# Altium schematic sheet Esquematico.SchDoc
size A3
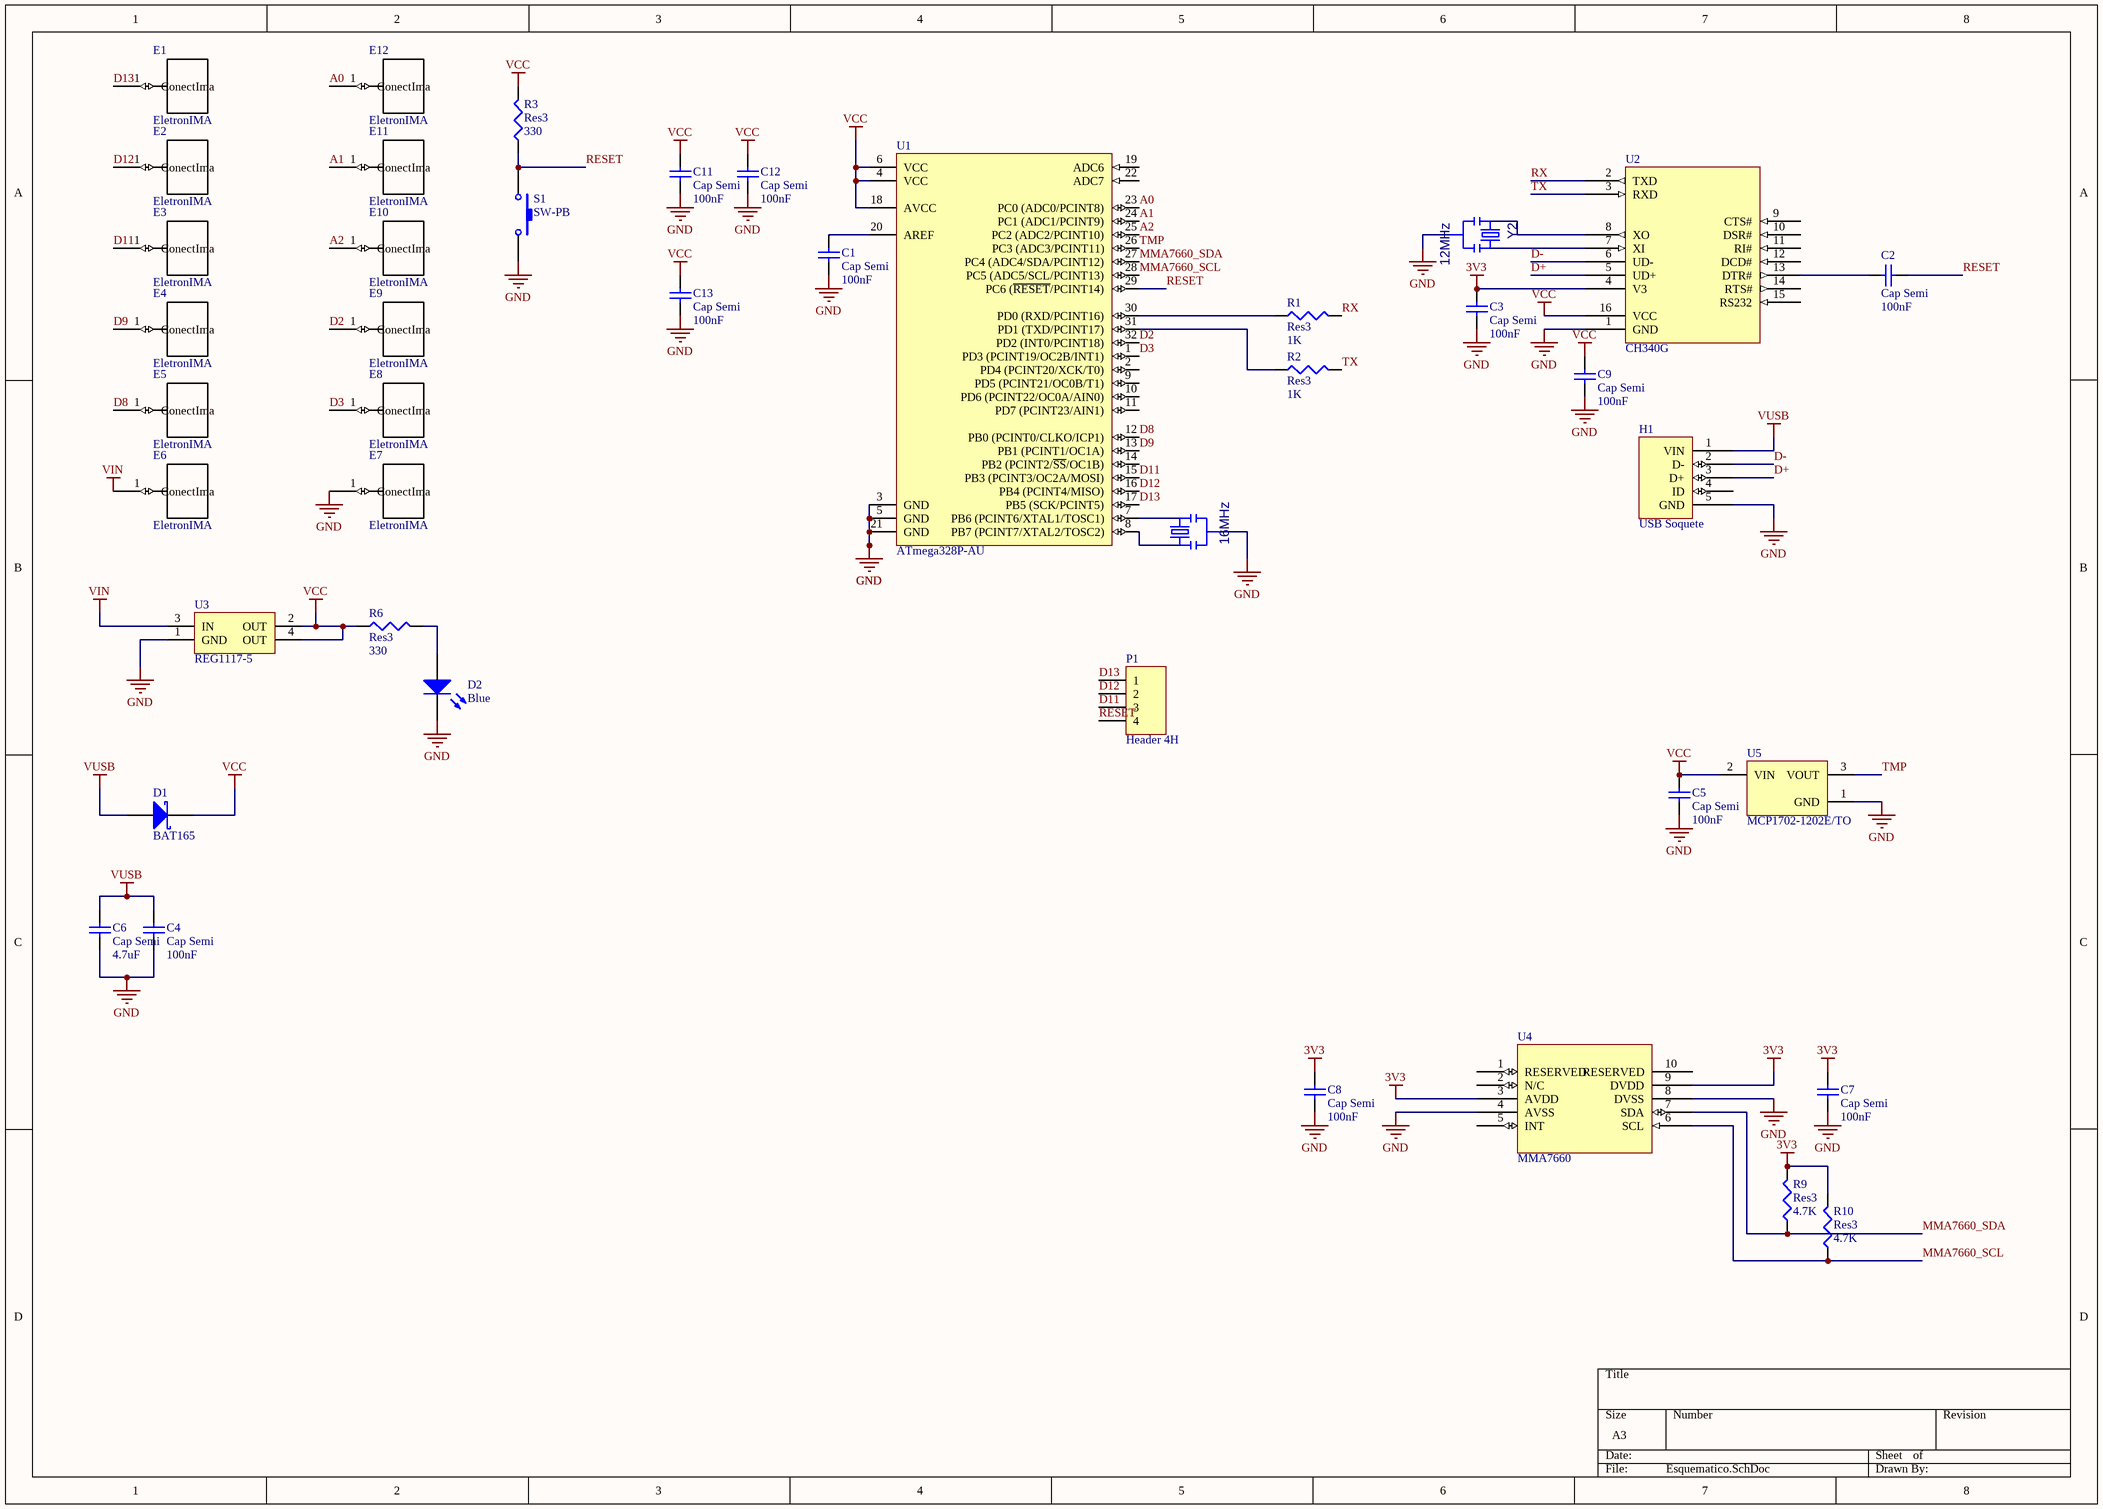
[diagram p0: Esquematico.SchDoc]

## Parts
C1  Cap Semi  value 100nF  [0402]
C2  Cap Semi  value 100nF  [0402]
C3  Cap Semi  value 100nF  [0402]
C4  Cap Semi  value 100nF  [0402]
C5  Cap Semi  value 100nF  [0402]
C6  Cap Semi  value 4.7uF  [0402]
C7  Cap Semi  value 100nF  [0402]
C8  Cap Semi  value 100nF  [0402]
C9  Cap Semi  value 100nF  [0402]
C11  Cap Semi  value 100nF  [0402]
C12  Cap Semi  value 100nF  [0402]
C13  Cap Semi  value 100nF  [0402]
D1  BAT165  [SOD-323]
D2  Blue  [1.6X0.8X0.6]
E1  EletronIMA  [TermIma]
E2  EletronIMA  [TermIma]
E3  EletronIMA  [TermIma]
E4  EletronIMA  [TermIma]
E5  EletronIMA  [TermIma]
E6  EletronIMA  [TermIma]
E7  EletronIMA  [TermIma]
E8  EletronIMA  [TermIma]
E9  EletronIMA  [TermIma]
E10  EletronIMA  [TermIma]
E11  EletronIMA  [TermIma]
E12  EletronIMA  [TermIma]
H1  USB Soquete  [ZX62RD-AB-5P8]
P1  Header 4H  [HDR1X4H]
R1  Res3  value 1K  [J1-0603]
R2  Res3  value 1K  [J1-0603]
R3  Res3  value 330  [J1-0603]
R6  Res3  value 330  [J1-0603]
R9  Res3  value 4.7K  [J1-0603]
R10  Res3  value 4.7K  [J1-0603]
S1  SW-PB  [SPST]
U1  ATmega328P-AU  [32A_N]
U2  CH340G  [SSOP20]
U3  REG1117-5  [SOT-223-DB3_M]
U4  MMA7660  [DFN-MF10]
U5  MCP1702-1202E/TO  [TO-92-TO3]
Y1  16MHz  [X3-SMD-3.6X1.3X0.8MM]
Y2  12MHz  [X3-SMD-3.6X1.3X0.8MM]

## Nets
3V3: C3.2 C7.2 C8.1 R9.2 R10.2 U2.4(V3) U4.3(AVDD) U4.9(DVDD)
GND: C1.1 C3.1 C4.1 C5.1 C6.1 C7.1 C8.2 C9.1 C11.1 C12.1 C13.1 D2.2(K) E7.1(ConectIma) H1.5(GND) S1.2 U1.3(GND) U1.5(GND) U1.21(GND) U2.1(GND) U3.1(GND) U4.4(AVSS) U4.8(DVSS) U5.1(GND) Y1.2 Y2.2
VCC: C5.2 C9.2 C11.2 C12.2 C13.2 D1.1(K) R3.2 R6.1 U1.4(VCC) U1.6(VCC) U1.18(AVCC) U2.16(VCC) U3.2(OUT) U3.4(OUT) U5.2(VIN)
VIN: E6.1(ConectIma) U3.3(IN)
VUSB: C4.2 C6.2 D1.2(A) H1.1(VIN)
A0: E12.1(ConectIma) U1.23(PC0_(ADC0/PCINT8))
A1: E11.1(ConectIma) U1.24(PC1_(ADC1/PCINT9))
A2: E10.1(ConectIma) U1.25(PC2_(ADC2/PCINT10))
D2: E9.1(ConectIma) U1.32(PD2_(INT0/PCINT18))
D3: E8.1(ConectIma) U1.1(PD3_(PCINT19/OC2B/INT1))
D8: E5.1(ConectIma) U1.12(PB0_(PCINT0/CLKO/ICP1))
D9: E4.1(ConectIma) U1.13(PB1_(PCINT1/OC1A))
D11: E3.1(ConectIma) P1.3 U1.15(PB3_(PCINT3/OC2A/MOSI))
D12: E2.1(ConectIma) P1.2 U1.16(PB4_(PCINT4/MISO))
D13: E1.1(ConectIma) P1.1 U1.17(PB5_(SCK/PCINT5))
D+: H1.3(D+) U2.5(UD+)
D-: H1.2(D-) U2.6(UD-)
MMA7660_SCL: R10.1 U1.28(PC5_(ADC5/SCL/PCINT13)) U4.6(SCL)
MMA7660_SDA: R9.1 U1.27(PC4_(ADC4/SDA/PCINT12)) U4.7(SDA)
RESET: C2.2 P1.4 R3.1 S1.1 U1.29(PC6_(~{RESET}/PCINT14))
RX: R1.2 U2.2(TXD)
TMP: U1.26(PC3_(ADC3/PCINT11)) U5.3(VOUT)
TX: R2.2 U2.3(RXD)
NetC1_2: C1.2 U1.20(AREF)
NetC2_1: C2.1 U2.13(DTR#)
NetD2_1: D2.1(A) R6.2
NetR1_1: R1.1 U1.30(PD0_(RXD/PCINT16))
NetR2_1: R2.1 U1.31(PD1_(TXD/PCINT17))
NetU1_7: U1.7(PB6_(PCINT6/XTAL1/TOSC1)) Y1.3
NetU1_8: U1.8(PB7_(PCINT7/XTAL2/TOSC2)) Y1.1
NetU2_7: U2.7(XI) Y2.3
NetU2_8: U2.8(XO) Y2.1

Not connected (* = marked no-connect by the designer): H1 4(ID); U1 2(PD4_(PCINT20/XCK/T0)) 9(PD5_(PCINT21/OC0B/T1)) 10(PD6_(PCINT22/OC0A/AIN0)) 11(PD7_(PCINT23/AIN1)) 14(PB2_(PCINT2/~{SS}/OC1B)) 19(ADC6) 22(ADC7); U2 9(CTS#) 10(DSR#) 11(RI#) 12(DCD#) 14(RTS#) 15(RS232); U4 1(RESERVED) 2(N/C) 5(INT) 10(RESERVED)

## Library data of the parts
C1-C9 C11-C13 = Cap Semi: Capacitor (Semiconductor SIM Model); Published: 8-Jun-2000; LatestRevisionDate: 29-May-2009; LatestRevisionNote: IPC-7351 Footprint Added.; PackageReference: C1206; Publisher: Altium Limited; PackageDescription: Chip Capacitor
D1 = BAT165: Silicon AF Schottky Rectifier Diode; Published: 21-Mar-2003; LatestRevisionDate: 19-Mar-2004; LatestRevisionNote: Silkscreen size reduced.; DatasheetDocument: Oct-1999; PackageDocument: Sep-2000; PackageReference: SOD-323; Publisher: Altium Limited; ComponentLink1Description: Manufacturer Link; ComponentLink1URL: http://www.infineon.com/; ComponentLink2Description: Datasheet; ComponentLink2URL: http://www.infineon.com/upload/Document/cmc_upload/documents/009/391/bat165series_1.pdf
D2 = HSMR-C191: Top Mount Low Profile Chip LED, Blue; LuminousIntensity: 16mcd (Minimum).; PCB_Layout: Complies with manufacturer's recommendation.; Published: 11-Dec-2002; DatasheetDocument: 6-Apr-2002; PackageDocument: 11-Mar-2002; PackageReference: 1.6X0.8X0.6; Publisher: Altium Limited; LED_Colour: Blue; ComponentLink1Description: Manufacturer Link; ComponentLink1URL: http://www.agilent.com/; ComponentLink2Description: Datasheet; ComponentLink2URL: http://cp.literature.agilent.com/litweb/pdf/5988-4832EN.pdf
P1 = Header 4H: Header, 4-Pin, Right Angle; LatestRevisionDate: 17-Jul-2002; LatestRevisionNote: Re-released for DXP Platform.; Publisher: Altium Limited
R1-R3 R6 R9 R10 = Res3: Resistor; Published: 8-Jun-2000; LatestRevisionDate: 29-May-2009; LatestRevisionNote: IPC-7351 Footprint Added.; PackageReference: J1-0603; Publisher: Altium Limited; PackageDescription: Chip Resistor
S1 = SW-PB: Switch; Published: 24-Mar-1999; LatestRevisionDate: 17-Jul-2002; LatestRevisionNote: Re-released for DXP Platform.; PackageReference: SPST-2; Publisher: Altium Limited; PackageDescription: Switch; 2 Leads
U1 = ATmega328P-AU: 8-bit AVR Microcontroller, 32KB Flash, 1KB EEPROM, 2KB SRAM, 32-pin TQFP, Industrial Grade (-40°C to 85°C); Published: 1-Apr-2010; DatasheetVersion: revA, Jan-2010; PackageVersion: revB, Oct-2001; PackageReference: 32A; Publisher: Altium Limited; PackageDescription: 32-Lead, 7x7x1.0 mm Body, 0.8mm Lead Pitch, Thin Profile Plastic Quad Flat Package (TQFP); Supplier 1: Digi-Key; Supplier Part Number 1: ATMEGA328P-AU-ND; Supplier 2: Farnell; Supplier Part Number 2: 1715486; Supplier 3: Mouser; Supplier Part Number 3: 556-ATMEGA328P-AU; Code_JEDEC: MS-026-ABA; ComponentLink1Description: Manufacturer Link; ComponentLink1URL: http://www.atmel.com/products/avr/default.asp?; ComponentLink2Description: ATmega48A/48PA/88A/88PA/168A/168PA/328/328P Datasheet; ComponentLink2URL: http://www.atmel.com/dyn/resources/prod_documents/8271.pdf; ComponentLink3Description: ATmega48A/48PA/88A/88PA/168A/168PA/328/328P Summary; ComponentLink3URL: http://www.atmel.com/dyn/resources/prod_documents/8271S.pdf; ComponentLink4Description: Atmel.com Home; ComponentLink4URL: http://www.atmel.com
U2 = CH340G: USB to UART interface
U3 = REG1117-5: 800mA and 1A Low Dropout Positive Regulator 2.85V, 3.3V, 5V, and Adjustable; Published: 8-Jun-2000; LatestRevisionDate: 17-Jul-2002; LatestRevisionNote: Re-released for DXP Platform.; DatasheetVersion: Sep-1997; PackageVersion: revC; PackageReference: ZZ311; Publisher: Altium Limited; PackageDescription: SOT-223/SC-73; 4 Leads; Body 6.7 x 7.3 mm, inc. leads (LxW max); ComponentLink1Description: Manufacturer Link; ComponentLink1URL: http://www.ti.com/; ComponentLink2Description: Datasheet; ComponentLink2URL: http://www-s.ti.com/sc/ds/REG1117.pdf
U4 = MMA7660: Digital 3-Axis-Accelerometers Sensor;±16g
U5 = MCP1702-1202E/TO: 250 mA Low Quiescent Current LDO Regulator, 3-Pin TO-92, Extended TemperatureBAG; Published: 29-Jan-2009; LatestRevisionDate: 02-Dec-2009; LatestRevisionNote: Updated to datasheet revision D, Jun-2009; DatasheetVersion: revD, Jun-2009; PackageVersion: revBB, Aug-2009; PackageReference: TO-92-TO3; Publisher: Altium Limited; PackageDescription: 3-Lead Plastic Transistor Outline (TO) [TO-92]; Supplier 1: Digi-Key; Supplier Part Number 1: MCP1702-1202E/TO-ND; ComponentLink1Description: Datasheet; ComponentLink1URL: http://ww1.microchip.com/downloads/en/DeviceDoc/22008d.pdf; ComponentLink2Description: Packaging Specification; ComponentLink2URL: http://www.microchip.com/stellent/groups/techpub_sg/documents/packagingspec/en012702.pdf; ComponentLink3Description: Microchip.com Home; ComponentLink3URL: http://www.microchip.com/
Y1 Y2 = SMD-RESONATOR-16MHZ-15PF-0.5%-40R(3P-3.2X1.3MM): Ceramic Resonator 16MHz ??0.5% (Tol) ??0.3% (Stability) 15pF 40Ohm 3-Pin CSMD T/R; MP: CSTCE16M0V53-R0; MF: Murata; Package: SMD-3 Murata; Price: 0.30 USD; Availability: Good
  Y1: Value: 16MHz
  Y2: Value: 12MHz